# Altium project PCB_Project.PrjPcb
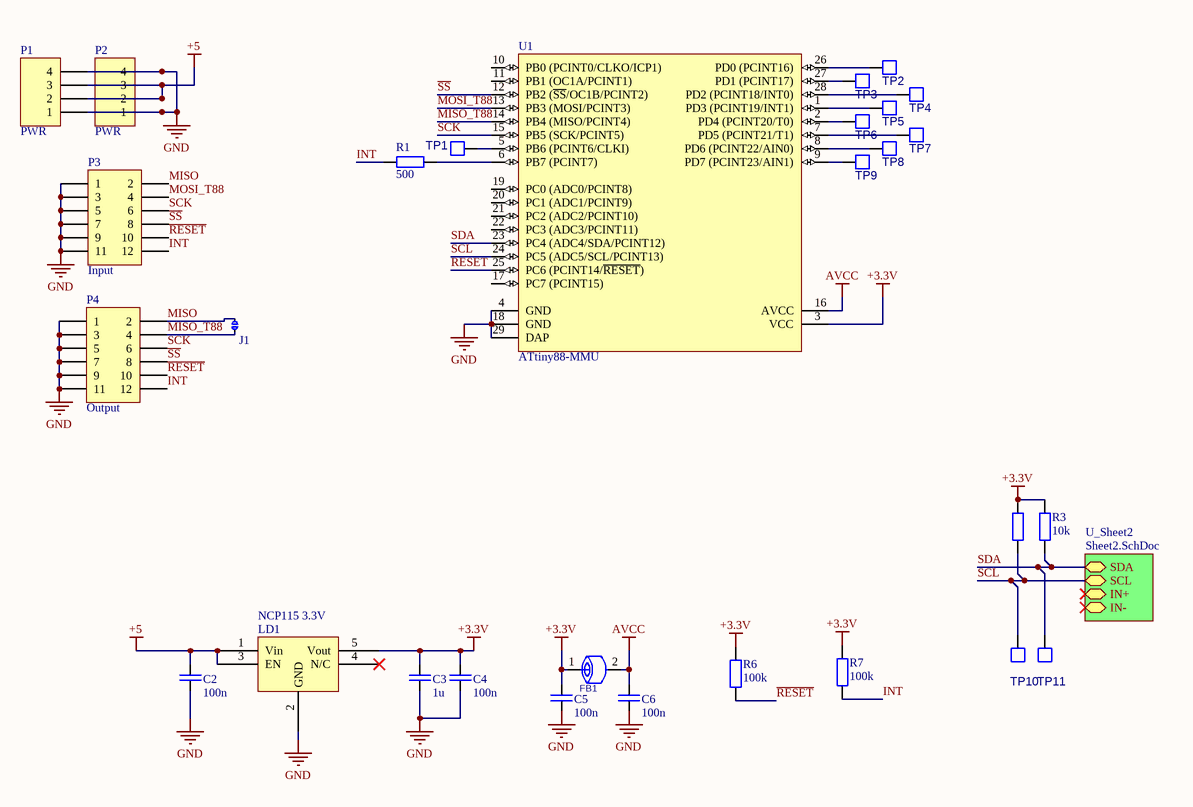
[diagram p0: Sheet1.SchDoc]
2 sheets, 40 parts. Net scope: hierarchical (ports join the sheet entries above them; power ports are global).
Board file: PCB1.PcbDoc
Sheets:
  Sheet1.SchDoc
    U_Sheet2 = Sheet2.SchDoc

## Sheet Sheet1.SchDoc
size A4

### Parts
C2  100n  [R1005_0402i_L]
C3  1u  [C1608_0603I_L]
C4  100n  [R1005_0402i_L]
C5  100n  [R1005_0402i_L]
C6  100n  [R1005_0402i_L]
FB1  FERITTE BEAD  [R1608_0603I_L]  (value not drawn)
J1  Terminator  [solderJumper]  (value not drawn)
LD1  NCP115 3.3V  [TSOP95P280X110-6L]
P1  PWR  [HDR1X4]
P2  PWR  [HDR1X4]
P3  Input  [1.27mm SMD conn]
P4  Output  [1.27mm SMD conn]
R1  500  [R1005_0402i_L]
R2  10k  [R1005_0402i_L]  (value not drawn)
R3  10k  [R1005_0402i_L]
R6  100k  [R1005_0402i_L]
R7  100k  [R1005_0402i_L]
TP1  PAD  [PAD]  (value not drawn)
TP2  PAD  [PAD]  (value not drawn)
TP3  PAD  [PAD]  (value not drawn)
TP4  PAD  [PAD]  (value not drawn)
TP5  PAD  [PAD]  (value not drawn)
TP6  PAD  [PAD]  (value not drawn)
TP7  PAD  [PAD]  (value not drawn)
TP8  PAD  [PAD]  (value not drawn)
TP9  PAD  [PAD]  (value not drawn)
TP10  PAD  [PAD]  (value not drawn)
TP11  PAD  [PAD]  (value not drawn)
U1  ATtiny88-MMU  [28M1_N]

### Sub-sheets
U_Sheet2 = Sheet2.SchDoc: SDA (bidir), SCL (bidir), IN+ (bidir), IN- (bidir)

### Nets
+3.3V: C3.1 C4.1 C5.1 FB1.1 LD1.5(Vout) R2.1 R3.1 R6.1 R7.1 U1.3(VCC)
+5: C2.1 LD1.1(Vin) LD1.3(EN) P1.2 P1.3 P2.2 P2.3
AVCC: C6.1 FB1.2 U1.16(AVCC)
GND: C2.2 C3.2 C4.2 C5.2 C6.2 LD1.2(GND) P1.1 P1.4 P2.1 P2.4 P3.1 P3.3 P3.5 P3.7 P3.9 P3.11 P4.1 P4.3 P4.5 P4.7 P4.9 P4.11 U1.4(GND) U1.18(GND) U1.29(DAP)
INT: P3.12 P4.12 R1.1 R7.2
MISO: J1.2 P3.2 P4.2
MISO_T88: J1.1 P4.4 U1.14(PB4_(MISO/PCINT4))
MOSI_T88: P3.4 U1.13(PB3_(MOSI/PCINT3))
~{RESET}: P3.10 P4.10 R6.2 U1.25(PC6_(PCINT14/~{RESET}))
~{SS}: P3.8 P4.8 U1.12(PB2_(~{SS}/OC1B/PCINT2))
SCK: P3.6 P4.6 U1.15(PB5_(SCK/PCINT5))
SCL: R2.2 TP10.1 U1.24(PC5_(ADC5/SCL/PCINT13)) ; sheet U_Sheet2/SCL
SDA: R3.2 TP11.1 U1.23(PC4_(ADC4/SDA/PCINT12)) ; sheet U_Sheet2/SDA
NetR1_2: R1.2 U1.6(PB7_(PCINT7))
NetTP1_1: TP1.1 U1.5(PB6_(PCINT6/CLKI))
NetTP2_1: TP2.1 U1.26(PD0_(PCINT16))
NetTP3_1: TP3.1 U1.27(PD1_(PCINT17))
NetTP4_1: TP4.1 U1.28(PD2_(PCINT18/INT0))
NetTP5_1: TP5.1 U1.1(PD3_(PCINT19/INT1))
NetTP6_1: TP6.1 U1.2(PD4_(PCINT20/T0))
NetTP7_1: TP7.1 U1.7(PD5_(PCINT21/T1))
NetTP8_1: TP8.1 U1.8(PD6_(PCINT22/AIN0))
NetTP9_1: TP9.1 U1.9(PD7_(PCINT23/AIN1))

Not connected (* = marked no-connect by the designer): LD1 4(N/C)*; U1 10(PB0_(PCINT0/CLKO/ICP1)) 11(PB1_(OC1A/PCINT1)) 17(PC7_(PCINT15)) 19(PC0_(ADC0/PCINT8)) 20(PC1_(ADC1/PCINT9)) 21(PC2_(ADC2/PCINT10)) 22(PC3_(ADC3/PCINT11))

### Library data of the parts
C2-C6 = C: Capacitor
J1 = JMP_mini
P1 P2 = Header 4: Header, 4-Pin; LatestRevisionDate: 17-Jul-2002; LatestRevisionNote: Re-released for DXP Platform.; Publisher: Altium Limited
P3 P4 = Header 6X2: Header, 6-Pin, Dual row; LatestRevisionDate: 17-Jul-2002; LatestRevisionNote: Re-released for DXP Platform.; Publisher: Altium Limited
R1-R3 R6 R7 = R
U1 = ATtiny88-MMU: 8-bit AVR Microcontroller, 1.8-5.5V, 8KB Flash, 64 Bytes EEPROM, 512 Bytes SRAM, 28-pin MLF, Industrial Grade (-40°C to 85°C), Pb-Free; Published: 1-Apr-2010; DatasheetVersion: revC, Mar-2009; PackageVersion: revB, Nov-2008; PackageReference: 28M1; Publisher: Altium Limited; PackageDescription: 28-pad, 4x4x1.0mm Body, Pitch 0.45mm, 2.4x2.4mm Exposed Pad, Plastic Very Thin QFN Package (VQFN); Supplier 1: Digi-Key; Supplier Part Number 1: ATTINY88-MMU-ND; Supplier 2: Mouser; Supplier Part Number 2: 556-ATTINY88-MMU; ComponentLink1Description: Manufacturer Link; ComponentLink1URL: http://www.atmel.com/products/avr/default.asp?; ComponentLink2Description: ATtiny48/88 Datasheet; ComponentLink2URL: http://www.atmel.com/dyn/resources/prod_documents/doc8008.pdf; ComponentLink3Description: ATtiny48/88 Summary; ComponentLink3URL: http://www.atmel.com/dyn/resources/prod_documents/8008S.pdf; ComponentLink4Description: Atmel.com Home; ComponentLink4URL: http://www.atmel.com

## Sheet Sheet2.SchDoc
size A4
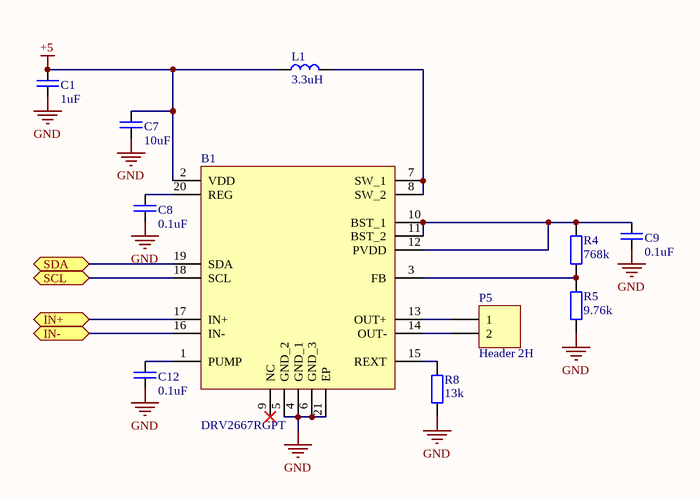
[diagram p1: Sheet2.SchDoc]

### Parts
B1  DRV2667RGPT  [QFN50P400X400X100-21N-D]
C1  1uF  [C2012_0805I_M]
C7  10uF  [C2012_0805I_M]
C8  0.1uF  [R1005_0402i_M]
C9  0.1uF  [C3216_1206I_L]
C12  0.1uF  [R1005_0402i_M]
L1  3.3uH  [INDUCTOR]
P5  Header 2H  [HDR1X2H]
R4  768k  [R1005_0402i_M]
R5  9.76k  [R1005_0402i_M]
R8  13k  [R1005_0402i_M]

### Ports
IN+ (bidir), IN- (bidir), SCL (bidir), SDA (bidir)

### Nets
+5: B1.2(VDD) C1.1 C7.1 L1.1
GND: B1.4(GND_1) B1.5(GND_2) B1.6(GND_3) B1.21(EP) C1.2 C7.2 C8.2 C9.2 C12.2 R5.2 R8.2
SCL: B1.18(SCL) ; port SCL
SDA: B1.19(SDA) ; port SDA
NetB1_1: B1.1(PUMP) C12.1
NetB1_3: B1.3(FB) R4.2 R5.1
NetB1_7: B1.7(SW_1) B1.8(SW_2) L1.2
NetB1_10: B1.10(BST_1) B1.11(BST_2) B1.12(PVDD) C9.1 R4.1
NetB1_13: B1.13(OUT+) P5.1
NetB1_14: B1.14(OUT-) P5.2
NetB1_15: B1.15(REXT) R8.1
NetB1_16: B1.16(IN-) ; port IN-
NetB1_17: B1.17(IN+) ; port IN+
NetB1_20: B1.20(REG) C8.1

Not connected (* = marked no-connect by the designer): B1 9(NC)*

### Library data of the parts
B1 = DRV2667RGPT: Motor / Motion / Ignition Controllers & Drivers Piezo Haptic Dvr w/ Boost Digital FE; Manufacturer_Name: Texas Instruments; Geometry.Height: 1mm; Mouser Part Number: 595-DRV2667RGPT; Mouser Price/Stock: https://www.mouser.co.uk/ProductDetail/Texas-Instruments/DRV2667RGPT?qs=5T7hXpf2iWdxn16iAzW0AQ%3D%3D; Manufacturer_Part_Number: DRV2667RGPT; Datasheet Link: https://www.ti.com/lit/ds/symlink/drv2667.pdf?HQS=TI-null-null-digikeymode-df-pf-null-wwe&ts=1600079349195
C1 C7-C9 C12 = C: Capacitor
L1 = L
P5 = Header 2H: Header, 2-Pin, Right Angle; LatestRevisionDate: 17-Jul-2002; LatestRevisionNote: Re-released for DXP Platform.; Publisher: Altium Limited
R4 R5 R8 = R

## Nets that join several sheets
+5: Sheet1 (7 pins), Sheet2 (B1.2 C1.1 C7.1 L1.1)
GND: Sheet1 (25 pins), Sheet2 (11 pins)
SCL: Sheet1 (R2.2 TP10.1 U1.24), Sheet2 (B1.18)
SDA: Sheet1 (R3.2 TP11.1 U1.23), Sheet2 (B1.19)